# Altium schematic sheet IVC_INTEGRATOR.SchDoc
size A4; SheetNumber: 8; SheetTotal: 11
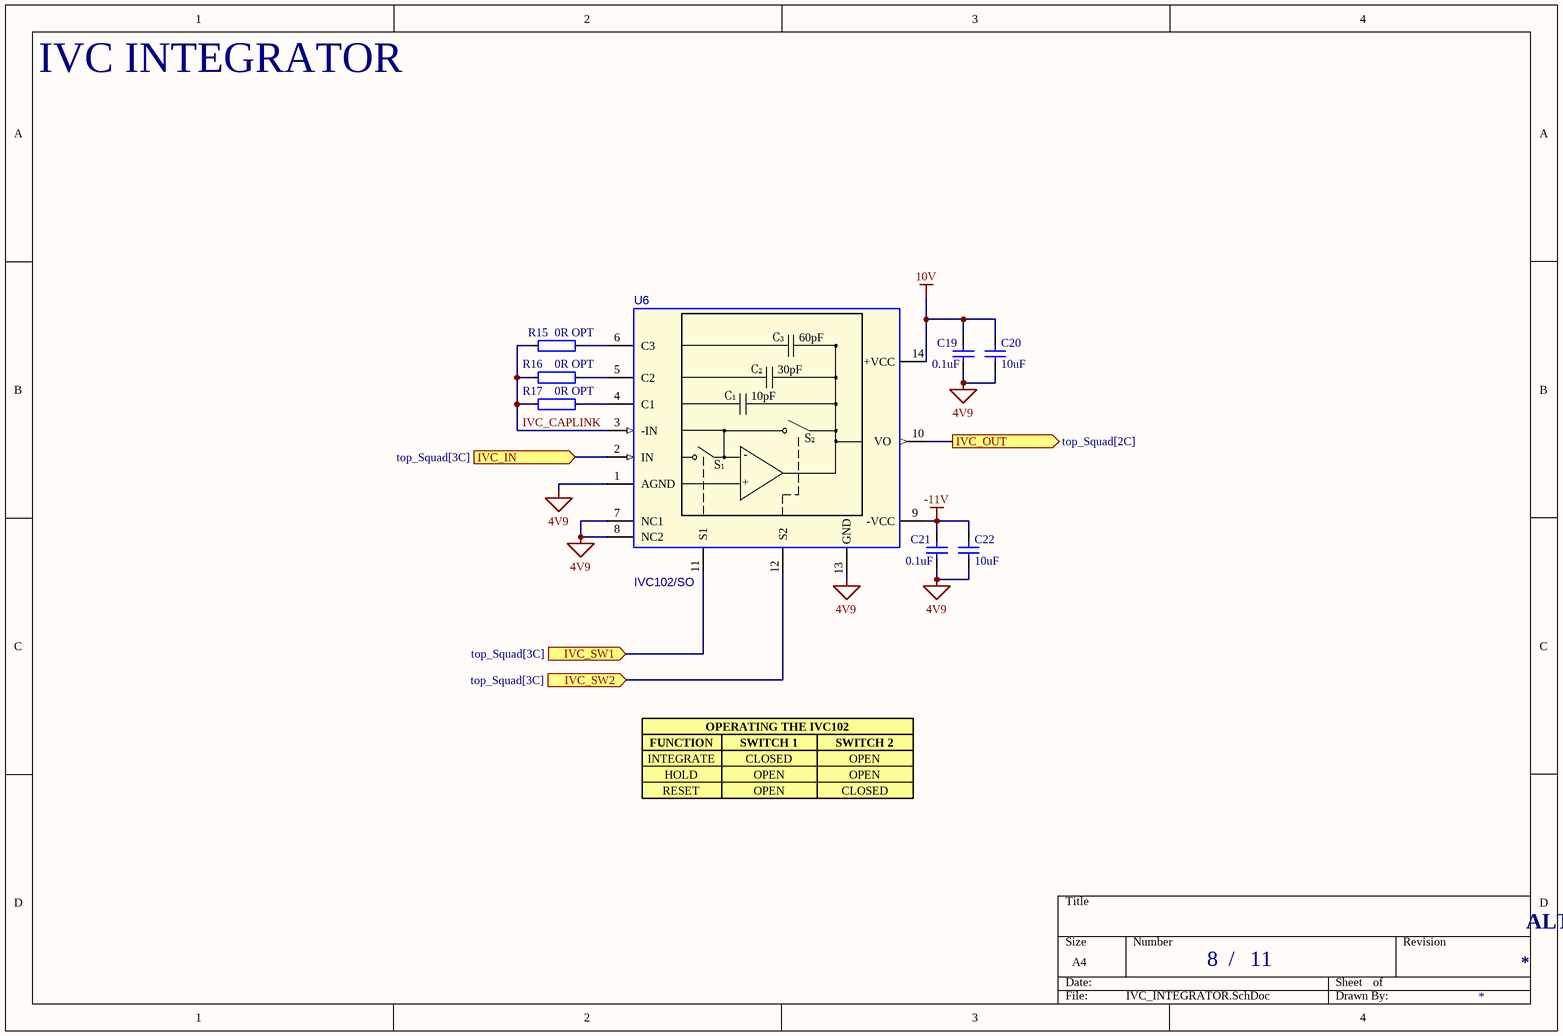
[diagram p0: IVC_INTEGRATOR.SchDoc]

## Parts
C19  0.1uF  [CAP 0603 NON-IPC KEMET X7R]
C20  10uF  [CAP 0805 IPC MID DENSITY]
C21  0.1uF  [CAP 0603 NON-IPC KEMET X7R]
C22  10uF  [CAP 0805 IPC MID DENSITY]
R15  0R OPT  [RES 0402 IPC LOW DENSITY]
R16  0R OPT  [RES 0402 IPC LOW DENSITY]
R17  0R OPT  [RES 0402 IPC LOW DENSITY]
U6  IVC102/SO  [14-SOIC 4MM WIDE LOW DENSITY]

## Ports
IVC_IN (in, see top_Squad[3C]), IVC_OUT (out, see top_Squad[2C]), IVC_SW1 (in, see top_Squad[3C]), IVC_SW2 (in, see top_Squad[3C])

## Nets
4V9: C19.1 C20.1 C21.1 C22.1 U6.1(AGND) U6.7(NC1) U6.8(NC2) U6.13(GND)
10V: C19.2 C20.2 U6.14(+VCC)
-11V: C21.2 C22.2 U6.9(-VCC)
IVC_CAPLINK: R15.1 R16.1 R17.1 U6.3(-IN)
IVC_IN: U6.2(IN) ; port IVC_IN
IVC_OUT: U6.10(VO) ; port IVC_OUT
IVC_SW1: U6.11(S1) ; port IVC_SW1
IVC_SW2: U6.12(S2) ; port IVC_SW2
NetR15_2: R15.2 U6.6(C3)
NetR16_2: R16.2 U6.5(C2)
NetR17_2: R17.2 U6.4(C1)

## Notes on the sheet
- IVC INTEGRATOR
- FUNCTION
- INTEGRATE
- HOLD
- OPERATING THE IVC102
- SWITCH 1
- CLOSED
- OPEN
- SWITCH 2
- RESET
- /
- ALTAIR PhotoDiode ReadOut (PDRO) - Squad
- (in symbol IVC102/SO_5) C₃; 60pF; C₂; 30pF; C₁; 10pF; S₂; -; S₁; +

## Library data of the parts
C19 C21 = CAP: Kemet C0603C104K5RACAUTO - Cap Ceramic 0.1uF 50V X7R 10% 0603 125C Paper T/R; MF: Kemet; MP: C0603C104K5RACAUTO
C20 C22 = CAP: Murata GRM21BR61E106KA73L - Cap Ceramic 10uF 10% 25V X5R 0805; MF: Murata; MP: GRM21BR61E106KA73L
R15-R17 = IMPEDANCE: Yageo RC0402JR-070RL - Res 0 Ohms 1/16W SMD 0402; MF: YAGEO; MP: RC0402JR-070RL
U6 = IVC102/SO_5: Precision Switched Integrator Transimpedance Amplifier; Part Reference: U1; MF: Texas Instruments; MP: IVC102U; Value: IVC102/SO